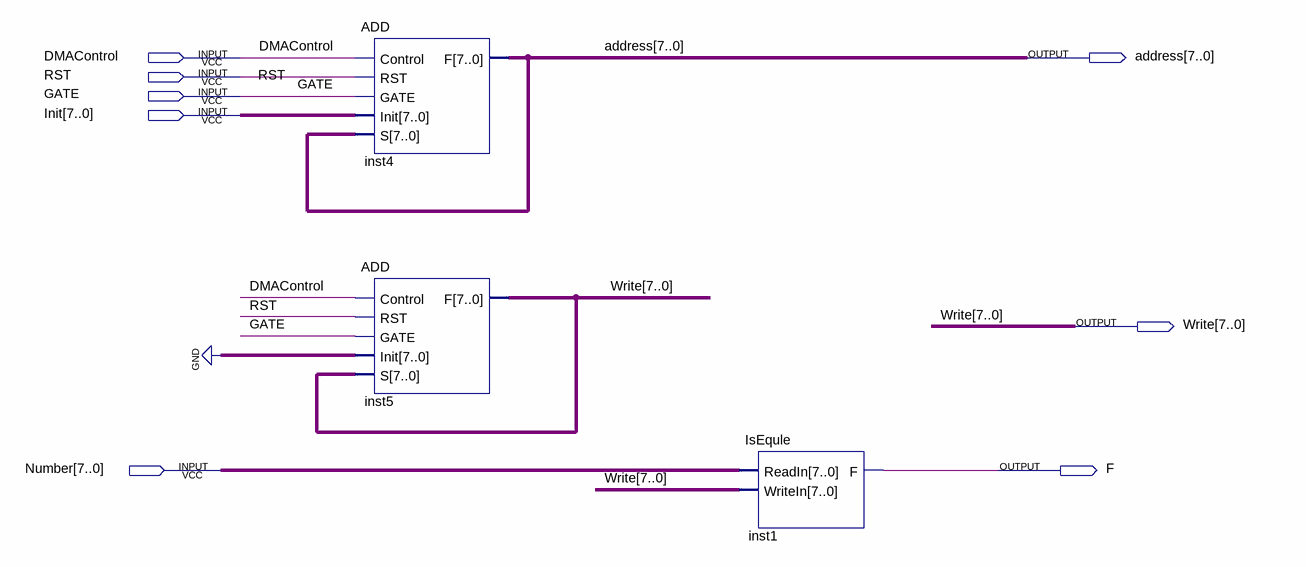
[diagram p0: schematic sheet]
// Quartus schematic MFDMA.bdf as structural Verilog: 3 symbols, 8 pins
module MFDMA (
  input  DMAControl,
  input  RST,
  input  GATE,
  input  [7:0] Init,
  input  [7:0] Number,
  output [7:0] address,
  output [7:0] Write,
  output F
);

  ADD inst4 (.Control(DMAControl), .RST(RST), .GATE(GATE), .Init(Init), .S(address), .F(address));
  ADD inst5 (.Control(DMAControl), .RST(RST), .GATE(GATE), .Init({8{1'b0}}), .S(Write), .F(Write));
  IsEqule inst1 (.ReadIn(Number), .WriteIn(Write), .F(F));
endmodule
